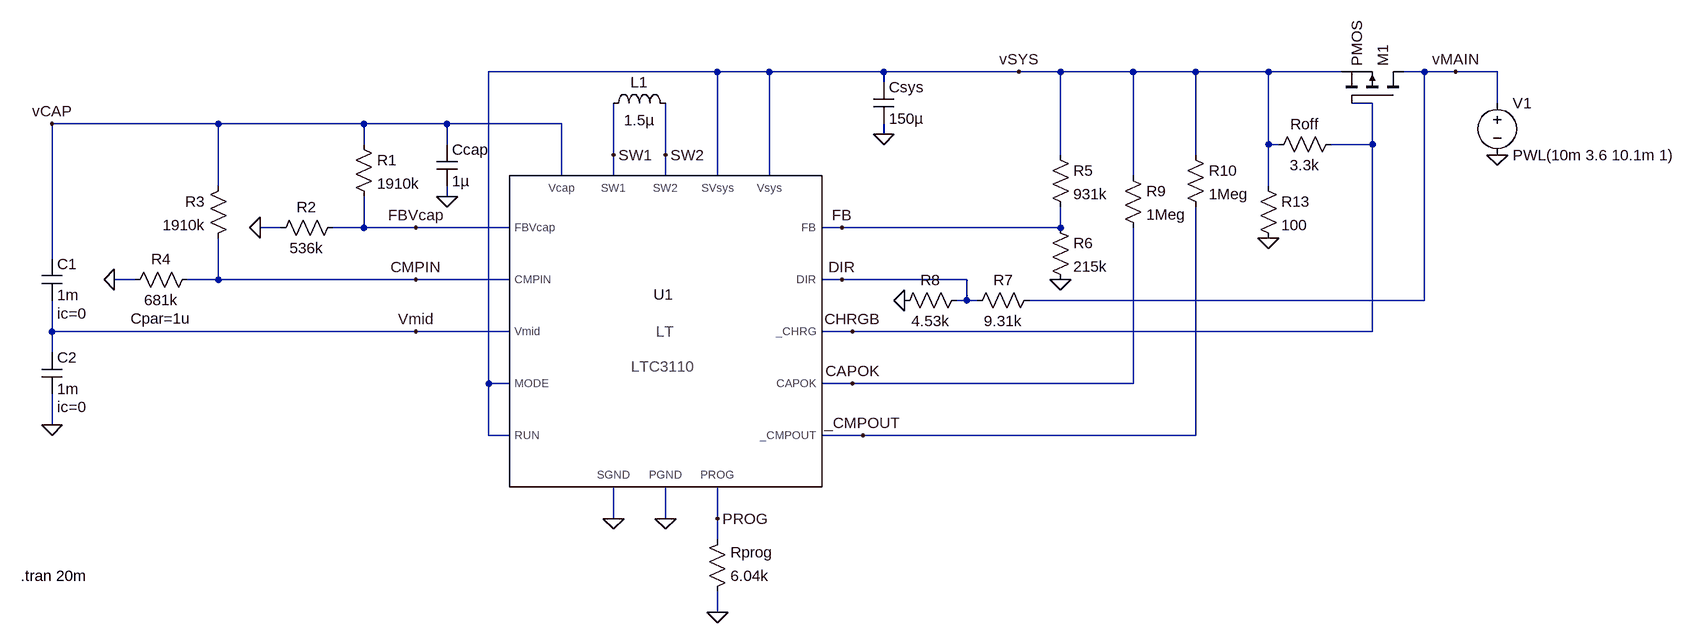
[diagram p0: schematic LTC3110.asc]
LTC3110.asc, the LTspice schematic file:
Version 4
SHEET 1 2332 692
WIRE 416 -224 64 -224
WIRE 496 -224 416 -224
WIRE 672 -224 496 -224
WIRE 880 -224 672 -224
WIRE 944 -224 880 -224
WIRE 1056 -224 944 -224
WIRE 1152 -224 1056 -224
WIRE 1264 -224 1152 -224
WIRE 1376 -224 1264 -224
WIRE 1504 -224 1472 -224
WIRE 1552 -224 1504 -224
WIRE 1616 -224 1552 -224
WIRE 672 -208 672 -224
WIRE 1424 -176 1392 -176
WIRE 1616 -176 1616 -224
WIRE -352 -144 -608 -144
WIRE -128 -144 -352 -144
WIRE 0 -144 -128 -144
WIRE 176 -144 0 -144
WIRE 672 -128 672 -144
WIRE -128 -112 -128 -144
WIRE 0 -112 0 -144
WIRE 1264 -112 1264 -224
WIRE 1280 -112 1264 -112
WIRE 1424 -112 1424 -176
WIRE 1424 -112 1360 -112
WIRE 256 -96 256 -176
WIRE 336 -96 336 -176
WIRE 944 -96 944 -224
WIRE 1152 -96 1152 -224
WIRE 176 -64 176 -144
WIRE 256 -64 256 -96
WIRE 336 -64 336 -96
WIRE 416 -64 416 -224
WIRE 496 -64 496 -224
WIRE 1056 -64 1056 -224
WIRE -352 -48 -352 -144
WIRE 1264 -48 1264 -112
WIRE 0 -32 0 -48
WIRE -256 16 -288 16
WIRE -128 16 -128 -32
WIRE -128 16 -176 16
WIRE -48 16 -128 16
WIRE 96 16 -48 16
WIRE 608 16 576 16
WIRE 944 16 944 -16
WIRE 944 16 608 16
WIRE -608 64 -608 -144
WIRE -480 96 -512 96
WIRE -352 96 -352 32
WIRE -352 96 -400 96
WIRE -48 96 -352 96
WIRE 96 96 -48 96
WIRE 608 96 576 96
WIRE 800 96 608 96
WIRE 800 128 800 96
WIRE 800 128 784 128
WIRE 816 128 800 128
WIRE 1504 128 1504 -224
WIRE 1504 128 896 128
WIRE -608 176 -608 128
WIRE -48 176 -608 176
WIRE 96 176 -48 176
WIRE 624 176 576 176
WIRE 1424 176 1424 -112
WIRE 1424 176 624 176
WIRE -608 208 -608 176
WIRE 64 256 64 -224
WIRE 96 256 64 256
WIRE 624 256 576 256
WIRE 1056 256 1056 16
WIRE 1056 256 624 256
WIRE -608 320 -608 272
WIRE 64 336 64 256
WIRE 96 336 64 336
WIRE 640 336 576 336
WIRE 1152 336 1152 -16
WIRE 1152 336 640 336
WIRE 256 464 256 416
WIRE 336 464 336 416
WIRE 416 464 416 416
WIRE 416 496 416 464
WIRE 416 608 416 576
FLAG -288 16 0
FLAG 0 -32 0
FLAG -512 96 0
FLAG -608 320 0
FLAG 672 -128 0
FLAG 416 608 0
FLAG 256 464 0
FLAG 336 464 0
FLAG -608 -144 vCAP
FLAG 944 96 0
FLAG 624 256 CAPOK
FLAG 640 336 _CMPOUT
FLAG 704 128 0
FLAG 608 96 DIR
FLAG 624 176 CHRGB
FLAG 1616 -96 0
FLAG 1264 32 0
FLAG -48 16 FBVcap
FLAG 416 464 PROG
FLAG 608 16 FB
FLAG -48 96 CMPIN
FLAG -48 176 Vmid
FLAG 256 -96 SW1
FLAG 336 -96 SW2
FLAG 880 -224 vSYS
FLAG 1552 -224 vMAIN
SYMBOL cap -16 -112 R0
SYMATTR InstName Ccap
SYMATTR Value 1µ
SYMBOL res -144 -128 R0
SYMATTR InstName R1
SYMATTR Value 1910k
SYMBOL res -272 32 R270
WINDOW 0 32 56 VTop 2
WINDOW 3 0 56 VBottom 2
SYMATTR InstName R2
SYMATTR Value 536k
SYMBOL res -336 -64 M0
SYMATTR InstName R3
SYMATTR Value 1910k
SYMBOL res -496 112 R270
WINDOW 0 32 56 VTop 2
WINDOW 3 0 56 VBottom 2
WINDOW 123 -28 56 VBottom 2
SYMATTR InstName R4
SYMATTR Value 681k
SYMATTR Value2 Cpar=1u
SYMBOL cap -624 64 R0
WINDOW 123 24 84 Left 2
SYMATTR Value2 ic=0
SYMATTR InstName C1
SYMATTR Value 1m
SYMBOL cap -624 208 R0
WINDOW 123 24 84 Left 2
SYMATTR Value2 ic=0
SYMATTR InstName C2
SYMATTR Value 1m
SYMBOL ind 352 -160 M270
WINDOW 0 32 56 VTop 2
WINDOW 3 5 56 VBottom 2
SYMATTR InstName L1
SYMATTR Value 1.5µ
SYMBOL cap 656 -208 R0
SYMATTR InstName Csys
SYMATTR Value 150µ
SYMBOL res 400 592 M180
WINDOW 0 36 76 Left 2
WINDOW 3 36 40 Left 2
SYMATTR InstName Rprog
SYMATTR Value 6.04k
SYMBOL res 928 0 R0
SYMATTR InstName R6
SYMATTR Value 215k
SYMBOL res 928 -112 R0
SYMATTR InstName R5
SYMATTR Value 931k
SYMBOL pmos 1472 -176 M270
SYMATTR InstName M1
SYMBOL res 1376 -128 R90
WINDOW 0 0 56 VBottom 2
WINDOW 3 32 56 VTop 2
SYMATTR InstName Roff
SYMATTR Value 3.3k
SYMBOL res 1040 -80 R0
SYMATTR InstName R9
SYMATTR Value 1Meg
SYMBOL res 1136 -112 R0
SYMATTR InstName R10
SYMATTR Value 1Meg
SYMBOL res 912 112 R90
WINDOW 0 0 56 VBottom 2
WINDOW 3 32 56 VTop 2
SYMATTR InstName R7
SYMATTR Value 9.31k
SYMBOL res 800 112 R90
WINDOW 0 0 56 VBottom 2
WINDOW 3 32 56 VTop 2
SYMATTR InstName R8
SYMATTR Value 4.53k
SYMBOL voltage 1616 -192 R0
WINDOW 123 0 0 Left 0
WINDOW 39 0 0 Left 0
SYMATTR InstName V1
SYMATTR Value PWL(10m 3.6 10.1m 1)
SYMBOL res 1248 -64 R0
SYMATTR InstName R13
SYMATTR Value 100
SYMBOL LTC3110 336 176 R0
SYMATTR InstName U1
TEXT -656 552 Left 2 !.tran 20m

The netlist it stands for:
* LTC3110.asc
Ccap vCAP 0 1µ
R1 vCAP FBVcap 1910k
R2 0 FBVcap 536k
R3 vCAP CMPIN 1910k
R4 0 CMPIN 681k Cpar=1u
C1 vCAP Vmid 1m ic=0
C2 Vmid 0 1m ic=0
L1 SW2 SW1 1.5µ
Csys vSYS 0 150µ
Rprog 0 PROG 6.04k
R6 FB 0 215k
R5 vSYS FB 931k
M1 vMAIN CHRGB vSYS vSYS PMOS
Roff CHRGB vSYS 3.3k
R9 vSYS CAPOK 1Meg
R10 vSYS _CMPOUT 1Meg
R7 vMAIN DIR 9.31k
R8 DIR 0 4.53k
V1 vMAIN 0 PWL(10m 3.6 10.1m 1)
R13 vSYS 0 100
XU1 CMPIN FBVcap 0 DIR vSYS FB PROG CHRGB CAPOK vSYS vSYS SW2 0 SW1 vCAP Vmid _CMPOUT vSYS LTC3110  ; pins CMPIN FBVcap SGND DIR RUN FB PROG _CHRG CAPOK Vsys SVsys SW2 PGND SW1 Vcap Vmid _CMPOUT MODE
.model NMOS NMOS
.model PMOS PMOS
.lib standard.mos
.tran 20m
.lib LTC3110.sub
.backanno
.end